# EasyEDA schematic SCH_snow_light.json
TITLE: 单键电容触摸雪花灯; REV: 1.0; Date: 2022-04-05; Sheet: 1/1; Drawn By: mondraker; Company: mondraker
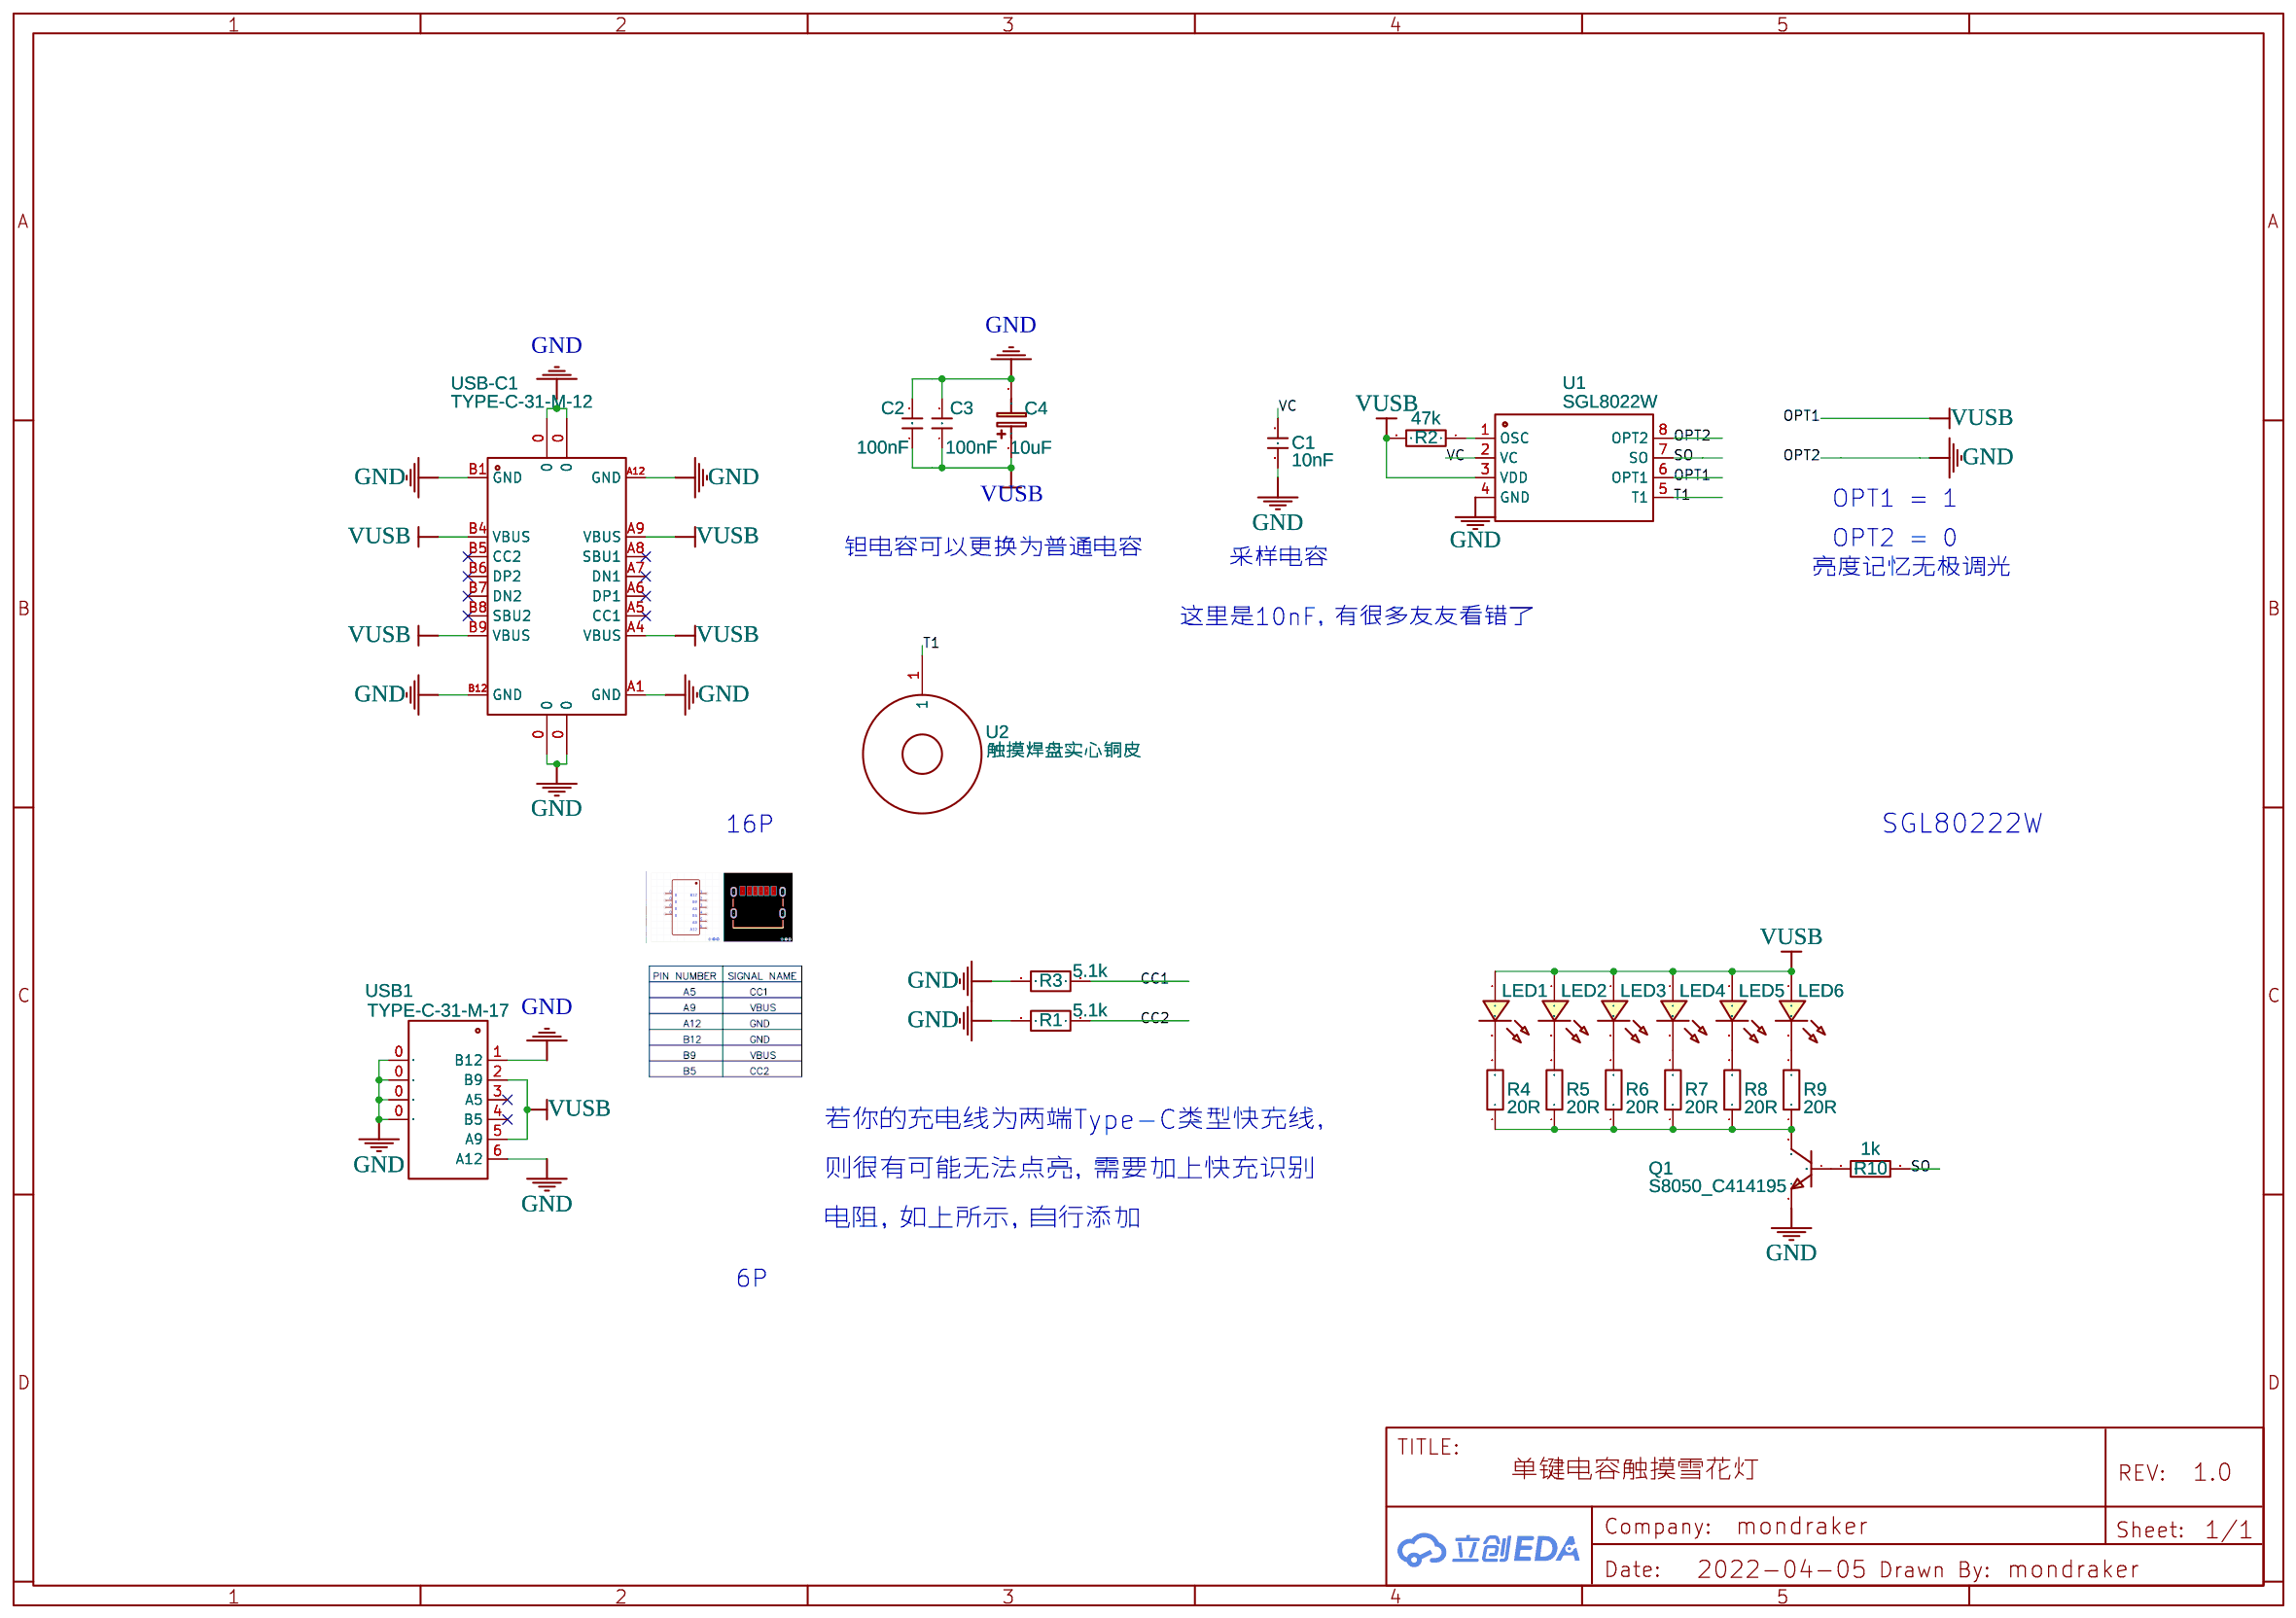
[diagram p0: schematic sheet]

## Parts
C1  10nF  [CAP 0603]
C2  100nF  [CAP 0603]
C3  100nF  [CAP 0603]
C4  10uF  [CASE-A_3216]
LED1  3V 26MM  [LED 26MM]
LED2  3V 26MM  [LED 26MM]
LED3  3V 26MM  [LED 26MM]
LED4  3V 26MM  [LED 26MM]
LED5  3V 26MM  [LED 26MM]
LED6  3V 26MM  [LED 26MM]
Q1  S8050_C414195  [SOT-23_L2.9-W1.3-P0.95-LS2.4-BR]
R1  5.1k  [R0402]
R2  47k  [RES-0603]
R3  5.1k  [R0402]
R4  20R  [RES-0603]
R5  20R  [RES-0603]
R6  20R  [RES-0603]
R7  20R  [RES-0603]
R8  20R  [RES-0603]
R9  20R  [RES-0603]
R10  1k  [RES-0603]
U1  SGL8022W  [SOP-8_L4.9-W3.9-P1.27-LS6.0-BL]
U2  触摸焊盘实心铜皮  [触摸焊盘]
USB1  TYPE-C-31-M-17  [USB-C-SMD_10P-P1.00-L6.8-W8.9]
USB-C1  TYPE-C-31-M-12  [USB-C_SMD-TYPE-C-31-M-12]

## Library data of the parts
C1-C3 = cap 0603: Supplier: LCSC; Supplier Part: C172738; Manufacturer: KEMET; Manufacturer Part: C0603C104K3RACAUTO; Contributor: dhx233
C4 = C_Tan_SMD_A_EU: Contributor: LCEDA_Lib
LED1-LED6 = LED  26MM: Contributor: XlinliY.Zhang
Q1 = S8050_C414195: Supplier: LCSC; Supplier Part: C414195; Manufacturer: GreenPower; Manufacturer Part: S8050; Contributor: LCSC
R1 R3 = R_0402_EU: Contributor: LCEDA_Lib
R2 R4-R10 = res-0603: Supplier: LCSC; Supplier Part: C335091; Manufacturer: Viking Tech; Manufacturer Part: ARG03BTC3003; Contributor: dhx233
U1 = SGL8022W: Supplier Part: C81650; Supplier: LCSC; Manufacturer: SIGMA; JLCPCB Part Class: Extended Part
U2 = 触摸焊盘实心铜皮: Manufacturer: no; Manufacturer Part: no; Supplier Part: no; link: no; Contributor: zk462750123
USB1 = TYPE-C-31-M-17: Supplier: LCSC; Supplier Part: C283540; Manufacturer: Korean Hroparts Elec; Contributor: LCSC; JLCPCB Part Class: Extended Part
USB-C1 = TYPE-C-31-M-12: Supplier: LCSC; Supplier Part: C165948; Manufacturer: Rectangular Connectors - Contacts; Contributor: LCSC; JLCPCB Part Class: Extended Part

## Nets
GND: C1.1 C2.2 C3.2 C4.2 Q1.2(E) R1.2 R3.2 U1.4(GND) U1.8(OPT2) USB1.0 USB1.1(B12) USB1.6(A12) USB-C1.0 USB-C1.A1(GND) USB-C1.A12(GND) USB-C1.B1(GND) USB-C1.B12(GND)
CC1: R3.1
CC2: R1.1
OPT1: C2.1 C3.1 C4.1 LED1.1 LED2.1 LED3.1 LED4.1 LED5.1 LED6.1 R2.2 U1.3(VDD) U1.6(OPT1) USB1.2(B9) USB1.5(A9) USB-C1.A4(VBUS) USB-C1.A9(VBUS) USB-C1.B4(VBUS) USB-C1.B9(VBUS)
SO: R10.2 U1.7(SO)
T1: U1.5(T1) U2.1
VC: C1.2 U1.2(VC)
Net-(LED1-2): LED1.2 R4.2
Net-(LED2-2): LED2.2 R5.2
Net-(LED3-2): LED3.2 R6.2
Net-(LED4-2): LED4.2 R7.2
Net-(LED5-2): LED5.2 R8.2
Net-(LED6-2): LED6.2 R9.2
Net-(Q1-1): Q1.1(B) R10.1
Net-(Q1-3): Q1.3(C) R4.1 R5.1 R6.1 R7.1 R8.1 R9.1
Net-(R2-1): R2.1 U1.1(OSC)

Not connected (* = marked no-connect by the designer): USB1 3(A5)* 4(B5)*; USB-C1 A5(CC1)* A6(DP1)* A7(DN1)* A8(SBU1)* B5(CC2)* B6(DP2)* B7(DN2)* B8(SBU2)*

## Notes on the sheet
- OPT1 = 1
- OPT2 = 0
- 钽电容可以更换为普通电容
- 采样电容
- 亮度记忆无极调光
- 这里是10nF，有很多友友看错了
- 16P
- SGL80222W
- 若你的充电线为两端Type-C类型快充线，
- 则很有可能无法点亮，需要加上快充识别
- 电阻，如上所示，自行添加
- 6P
